# Altium schematic sheet Sheet1.SchDoc
size A3
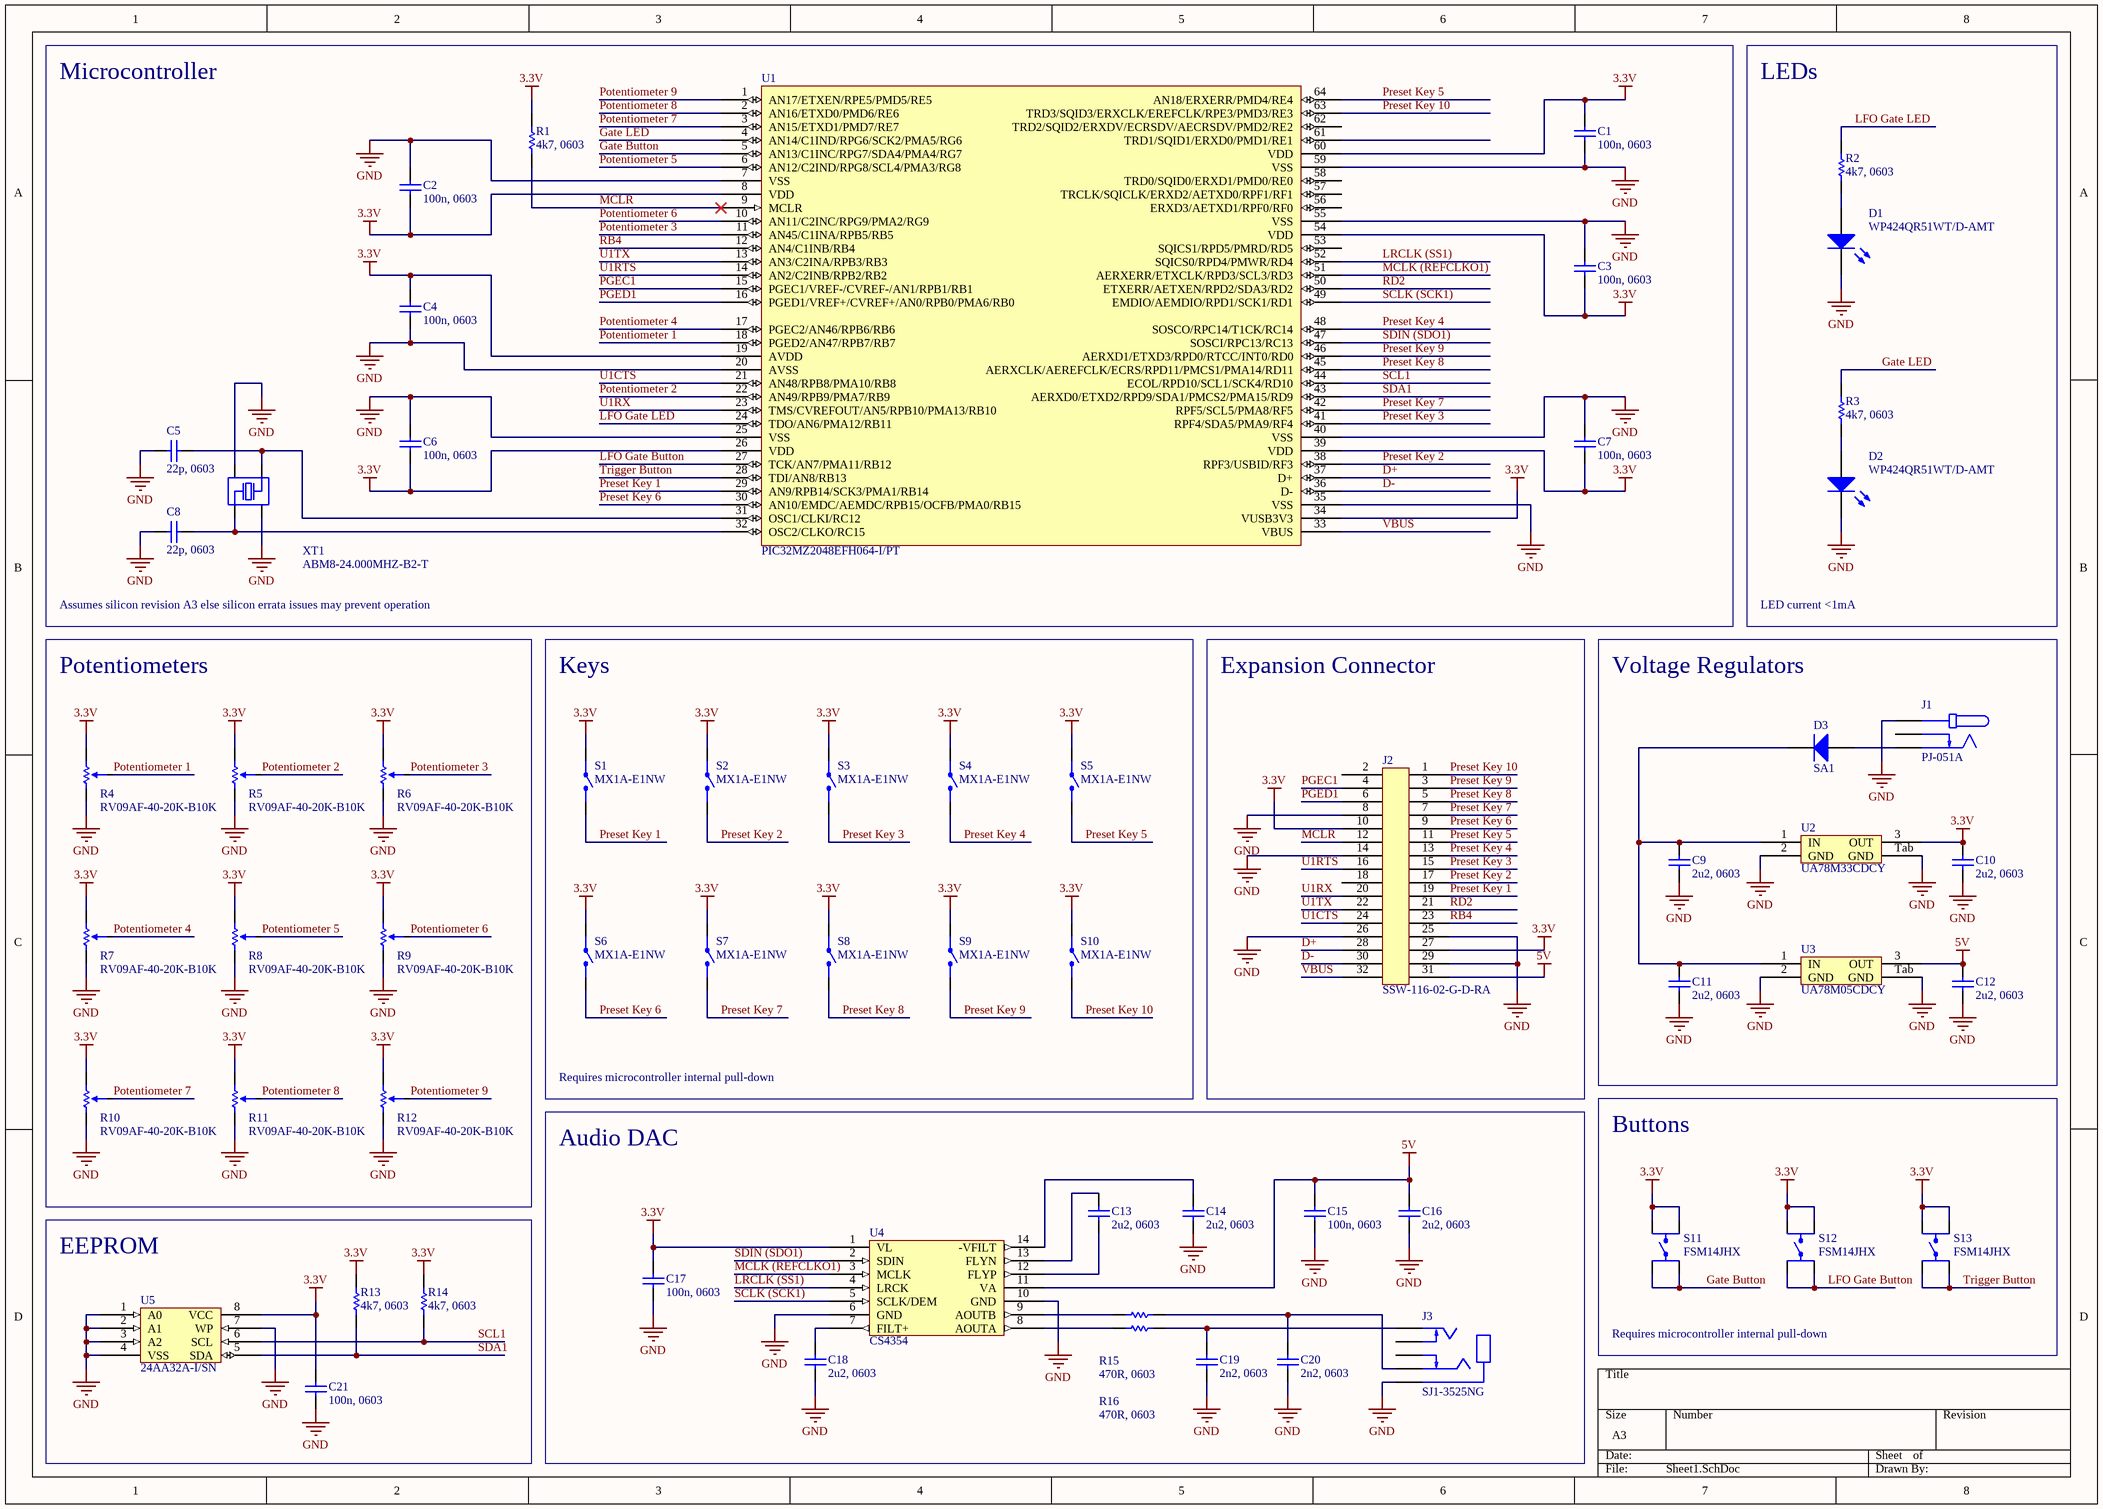
[diagram p0: Sheet1.SchDoc]

## Parts
C1  100n, 0603  [Capacitor 0603]
C2  100n, 0603  [Capacitor 0603]
C3  100n, 0603  [Capacitor 0603]
C4  100n, 0603  [Capacitor 0603]
C5  22p, 0603  [Capacitor 0603]
C6  100n, 0603  [Capacitor 0603]
C7  100n, 0603  [Capacitor 0603]
C8  22p, 0603  [Capacitor 0603]
C9  2u2, 0603  [Capacitor 0603]
C10  2u2, 0603  [Capacitor 0603]
C11  2u2, 0603  [Capacitor 0603]
C12  2u2, 0603  [Capacitor 0603]
C13  2u2, 0603  [Capacitor 0603]
C14  2u2, 0603  [Capacitor 0603]
C15  100n, 0603  [Capacitor 0603]
C16  2u2, 0603  [Capacitor 0603]
C17  100n, 0603  [Capacitor 0603]
C18  2u2, 0603  [Capacitor 0603]
C19  2n2, 0603  [Capacitor 0603]
C20  2n2, 0603  [Capacitor 0603]
C21  100n, 0603  [Capacitor 0603]
D1  WP424QR51WT/D-AMT  [LED 3mm]
D2  WP424QR51WT/D-AMT  [LED 3mm]
D3  SA1  [DO-214AC]
J1  PJ-051A  [PJ-051A]
J2  SSW-116-02-G-D-RA  [SSW-116-02-G-D-RA]
J3  SJ1-3525NG  [SJ1-3525NG]
R1  4k7, 0603  [Resistor 0603]
R2  4k7, 0603  [Resistor 0603]
R3  4k7, 0603  [Resistor 0603]
R4  RV09AF-40-20K-B10K  [RV09ACF-40]
R5  RV09AF-40-20K-B10K  [RV09ACF-40]
R6  RV09AF-40-20K-B10K  [RV09ACF-40]
R7  RV09AF-40-20K-B10K  [RV09ACF-40]
R8  RV09AF-40-20K-B10K  [RV09ACF-40]
R9  RV09AF-40-20K-B10K  [RV09ACF-40]
R10  RV09AF-40-20K-B10K  [RV09ACF-40]
R11  RV09AF-40-20K-B10K  [RV09ACF-40]
R12  RV09AF-40-20K-B10K  [RV09ACF-40]
R13  4k7, 0603  [Resistor 0603]
R14  4k7, 0603  [Resistor 0603]
R15  470R, 0603  [Resistor 0603]
R16  470R, 0603  [Resistor 0603]
S1  MX1A-E1NW  [MX1A]
S2  MX1A-E1NW  [MX1A]
S3  MX1A-E1NW  [MX1A]
S4  MX1A-E1NW  [MX1A]
S5  MX1A-E1NW  [MX1A]
S6  MX1A-E1NW  [MX1A]
S7  MX1A-E1NW  [MX1A]
S8  MX1A-E1NW  [MX1A]
S9  MX1A-E1NW  [MX1A]
S10  MX1A-E1NW  [MX1A]
S11  FSM14JHX  [FSM14JHX]
S12  FSM14JHX  [FSM14JHX]
S13  FSM14JHX  [FSM14JHX]
U1  PIC32MZ2048EFH064-I/PT  [TQFP64]
U2  UA78M33CDCY  [SOT-223]
U3  UA78M05CDCY  [SOT-223]
U4  CS4354  [SOIC14]
U5  24AA32A-I/SN  [SOIC8]
XT1  ABM8-24.000MHZ-B2-T  [ABM8]

## Blocks framed on the sheet
Microcontroller: C1-C8 R1 U1 XT1
LEDs: D1 D2 R2 R3
Potentiometers: R4-R12
Keys: S1-S10
Expansion Connector: J2
Voltage Regulators: C9-C12 D3 J1 U2 U3
Buttons: S11-S13
Audio DAC: C13-C20 J3 R15 R16 U4
EEPROM: C21 R13 R14 U5

## Nets
3.3V: C1.1 C2.1 C3.2 C4.2 C6.1 C7.2 C10.2 C17.2 C21.2 J2.10 J2.27 R1.2 R4.3 R5.3 R6.3 R7.3 R8.3 R9.3 R10.3 R11.3 R12.3 R13.2 R14.2 S1.1 S2.1 S3.1 S4.1 S5.1 S6.1 S7.1 S8.1 S9.1 S10.1 S11.3 S11.4 S12.3 S12.4 S13.3 S13.4 U1.8(VDD) U1.19(AVDD) U1.26(VDD) U1.34(VUSB3V3) U1.39(VDD) U1.54(VDD) U1.60(VDD) U2.3(OUT) U4.1(VL) U5.8(VCC)
5V: C12.2 C15.2 C16.2 J2.31 U3.3(OUT) U4.11(VA)
GND: C1.2 C2.2 C3.1 C4.1 C5.1 C6.2 C7.1 C8.1 C9.1 C10.1 C11.1 C12.1 C14.1 C15.1 C16.1 C17.1 C18.1 C19.1 C20.1 C21.1 D1.K D2.K J1.1 J2.8 J2.14 J2.25 J2.26 J2.29 J3.1(sleeve) R4.1 R5.1 R6.1 R7.1 R8.1 R9.1 R10.1 R11.1 R12.1 U1.7(VSS) U1.20(AVSS) U1.25(VSS) U1.35(VSS) U1.40(VSS) U1.55(VSS) U1.59(VSS) U2.2(GND) U2.Tab(GND) U3.2(GND) U3.Tab(GND) U4.6(GND) U4.10(GND) U5.1(A0) U5.2(A1) U5.3(A2) U5.4(VSS) U5.7(WP) XT1.2(GND) XT1.4(GND)
D+: J2.28 U1.37(D+)
D-: J2.30 U1.36(D-)
Gate Button: S11.1 S11.2 U1.5(AN13/C1INC/RPG7/SDA4/PMA4/RG7)
Gate LED: R3.2 U1.4(AN14/C1IND/RPG6/SCK2/PMA5/RG6)
LFO Gate Button: S12.1 S12.2 U1.27(TCK/AN7/PMA11/RB12)
LFO Gate LED: R2.2 U1.24(TDO/AN6/PMA12/RB11)
LRCLK (SS1): U1.52(SQICS0/RPD4/PMWR/RD4) U4.4(LRCK)
MCLK (REFCLKO1): U1.51(AERXERR/ETXCLK/RPD3/SCL3/RD3) U4.3(MCLK)
MCLR: J2.12 R1.1 U1.9(MCLR)
PGEC1: J2.4 U1.15(PGEC1/VREF-/CVREF-/AN1/RPB1/RB1)
PGED1: J2.6 U1.16(PGED1/VREF+/CVREF+/AN0/RPB0/PMA6/RB0)
Potentiometer 1: R4.2 U1.18(PGED2/AN47/RPB7/RB7)
Potentiometer 2: R5.2 U1.22(AN49/RPB9/PMA7/RB9)
Potentiometer 3: R6.2 U1.11(AN45/C1INA/RPB5/RB5)
Potentiometer 4: R7.2 U1.17(PGEC2/AN46/RPB6/RB6)
Potentiometer 5: R8.2 U1.6(AN12/C2IND/RPG8/SCL4/PMA3/RG8)
Potentiometer 6: R9.2 U1.10(AN11/C2INC/RPG9/PMA2/RG9)
Potentiometer 7: R10.2 U1.3(AN15/ETXD1/PMD7/RE7)
Potentiometer 8: R11.2 U1.2(AN16/ETXD0/PMD6/RE6)
Potentiometer 9: R12.2 U1.1(AN17/ETXEN/RPE5/PMD5/RE5)
Preset Key 1: J2.19 S1.2 U1.29(AN9/RPB14/SCK3/PMA1/RB14)
Preset Key 2: J2.17 S2.2 U1.38(RPF3/USBID/RF3)
Preset Key 3: J2.15 S3.2 U1.41(RPF4/SDA5/PMA9/RF4)
Preset Key 4: J2.13 S4.2 U1.48(SOSCO/RPC14/T1CK/RC14)
Preset Key 5: J2.11 S5.2 U1.64(AN18/ERXERR/PMD4/RE4)
Preset Key 6: J2.9 S6.2 U1.30(AN10/EMDC/AEMDC/RPB15/OCFB/PMA0/RB15)
Preset Key 7: J2.7 S7.2 U1.42(RPF5/SCL5/PMA8/RF5)
Preset Key 8: J2.5 S8.2 U1.45(AERXCLK/AEREFCLK/ECRS/RPD11/PMCS1/PMA14/RD11)
Preset Key 9: J2.3 S9.2 U1.46(AERXD1/ETXD3/RPD0/RTCC/INT0/RD0)
Preset Key 10: J2.1 S10.2 U1.63(TRD3/SQID3/ERXCLK/EREFCLK/RPE3/PMD3/RE3)
RB4: J2.23 U1.12(AN4/C1INB/RB4)
RD2: J2.21 U1.50(ETXERR/AETXEN/RPD2/SDA3/RD2)
SCL1: R14.1 U1.44(ECOL/RPD10/SCL1/SCK4/RD10) U5.6(SCL)
SCLK (SCK1): U1.49(EMDIO/AEMDIO/RPD1/SCK1/RD1) U4.5(SCLK/DEM)
SDA1: R13.1 U1.43(AERXD0/ETXD2/RPD9/SDA1/PMCS2/PMA15/RD9) U5.5(SDA)
SDIN (SDO1): U1.47(SOSCI/RPC13/RC13) U4.2(SDIN)
Trigger Button: S13.1 S13.2 U1.28(TDI/AN8/RB13)
U1CTS: J2.24 U1.21(AN48/RPB8/PMA10/RB8)
U1RTS: J2.16 U1.14(AN2/C2INB/RPB2/RB2)
U1RX: J2.20 U1.23(TMS/CVREFOUT/AN5/RPB10/PMA13/RB10)
U1TX: J2.22 U1.13(AN3/C2INA/RPB3/RB3)
VBUS: J2.32 U1.33(VBUS)
NetC5_2: C5.2 U1.31(OSC1/CLKI/RC12) XT1.1(XT1)
NetC8_2: C8.2 U1.32(OSC2/CLKO/RC15) XT1.3(XT2)
NetC9_2: C9.2 C11.2 D3.K U2.1(IN) U3.1(IN)
NetC13_1: C13.1 U4.12(FLYP)
NetC13_2: C13.2 U4.13(FLYN)
NetC14_2: C14.2 U4.14(-VFILT)
NetC18_2: C18.2 U4.7(FILT+)
NetC19_2: C19.2 J3.2(tip) R16.2
NetC20_2: C20.2 J3.3(ring) R15.2
NetD1_A: D1.A R2.1
NetD2_A: D2.A R3.1
NetD3_A: D3.A J1.2
NetR15_1: R15.1 U4.9(AOUTB)
NetR16_1: R16.1 U4.8(AOUTA)

Not connected (* = marked no-connect by the designer): J1 3; J2 2(*) 18(*); J3 4(tip_switch) 5(ring_switch); U1 53(SQICS1/RPD5/PMRD/RD5) 56(ERXD3/AETXD1/RPF0/RF0) 57(TRCLK/SQICLK/ERXD2/AETXD0/RPF1/RF1) 58(TRD0/SQID0/ERXD1/PMD0/RE0) 61(TRD1/SQID1/ERXD0/PMD1/RE1) 62(TRD2/SQID2/ERXDV/ECRSDV/AECRSDV/PMD2/RE2)

## Notes on the sheet
- Assumes silicon revision A3 else silicon errata issues may prevent operation
- LED current <1mA
- Requires microcontroller internal pull-down

## Library data of the parts
C1-C21 = Capacitor
D1 D2 = LED
D3 = Diode
R1-R3 R13-R16 = Resistor
R4-R12 = Potentiometer
S1-S10 = MX1A
S11-S13 = Tactile Switch
U2 U3 = µA78Mxx
U5 = 24AAxx
XT1 = ABM8-16.000MHz-B2-T